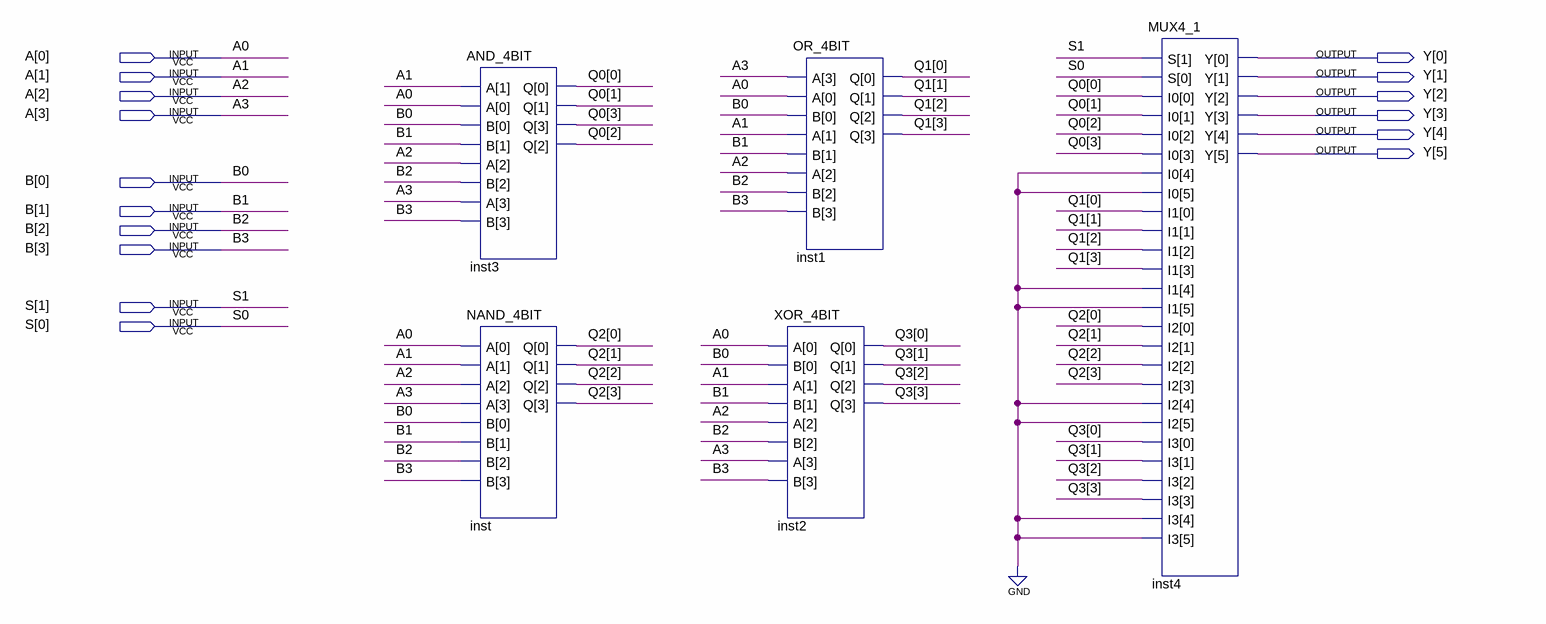
[diagram p0: schematic sheet]
// Quartus schematic LU.bdf as structural Verilog: 5 symbols, 16 pins
module LU (
  input  [3:0] A,
  input  [3:0] B,
  input  [1:0] S,
  output [5:0] Y
);

  wire [3:0] Q0, Q1, Q2, Q3;

  AND_4BIT inst3 (.A(A), .B(B), .Q(Q0));
  NAND_4BIT inst (.A(A), .B(B), .Q(Q2));
  XOR_4BIT inst2 (.A(A), .B(B), .Q(Q3));
  OR_4BIT inst1 (.A(A), .B(B), .Q(Q1));
  MUX4_1 inst4 (.S(S), .I0({2'b00, Q0}), .I1({2'b00, Q1}), .I2({2'b00, Q2}), .I3({2'b00, Q3}), .Y(Y));
endmodule
